# EAGLE design mux_imu (EAGLE 9.6.2)
COMPANY: ADAFRUIT INDUSTRIES; DRAWN: KTOWN; REV: A
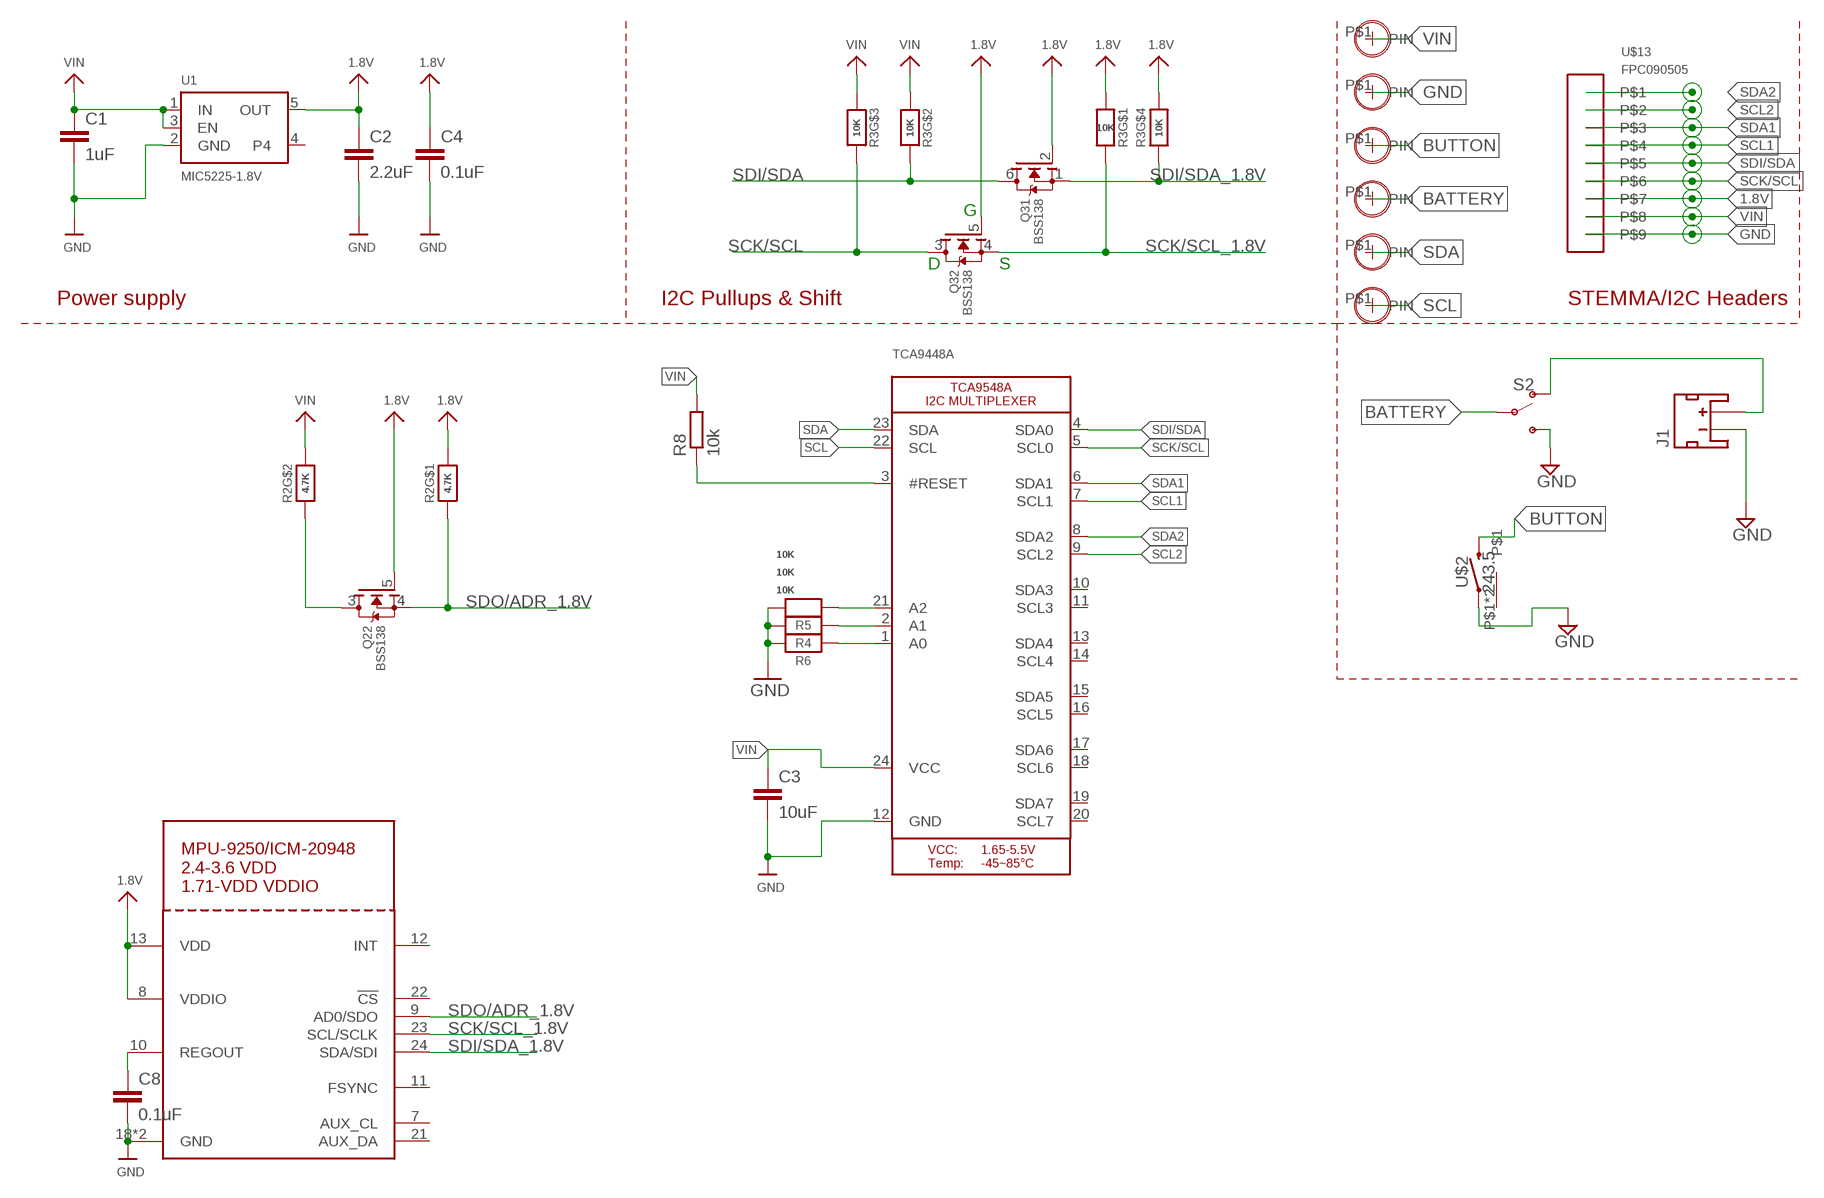
[diagram p0: schematic, sheet 1]

## Parts
C1  1uF  C-EUC0402  [C0402]
C2  2.2uF  C-EUC0402  [C0402]
C3  10uF  C-EUC0402  [C0402]
C4  0.1uF  C-EUC0402  [C0402]
C8  0.1uF  C-EUC0402  [C0402]
J1  JST_2MM_MALE  [JST-2-SMD]
Q2  BSS138  MOSFET-N_DUAL  [SOT363]
Q3  BSS138  MOSFET-N_DUAL  [SOT363]
R2  4.7K  RESISTOR_4PACK  [RESPACK_4X0603]
R3  10K  RESISTOR_4PACK  [RESPACK_4X0603]
R4  10K  RESISTOR0805_NOOUTLINE  [0805-NO]
R5  10K  RESISTOR0805_NOOUTLINE  [0805-NO]
R6  10K  RESISTOR0805_NOOUTLINE  [0805-NO]
R8  10k  R-EU_R0805  [R0805]
S2  SWITCH-SPDT-SMD-RIGHT-ANGLE  [SWITCH_SPST_SMD_A]
TCA9448A  MICROBUILDER_TCA9548A  [MICROBUILDER_TSSOP24]
U1  MIC5225-1.8V  VREG_SOT23-5  [SOT23-5]
U$2  243.5  [2*4*3.5]
U$3  M0.9-HOLE0.9MM  [M0.9-HOLE]
U$6  M0.9-HOLE0.9MM  [M0.9-HOLE]
U$8  M0.9-HOLE0.9MM  [M0.9-HOLE]
U$9  M0.9-HOLE0.9MM  [M0.9-HOLE]
U$10  M0.9-HOLE0.9MM  [M0.9-HOLE]
U$12  M0.9-HOLE0.9MM  [M0.9-HOLE]
U$13  FPC090505  [FPC0905]
U$21  MPU-9250_ICM20948  [QFN24_3MM_NOEP]

## Nets
1.8V: C2.1 C4.1 Q2.5(2:G) Q3.2(1:G) Q3.5(2:G) R2.8 R3.4 R3.8 U1.5(OUT) U$13.P$7 U$21.8(VDDIO) U$21.13(VDD)
BATTERY: S2.2(P) U$10.P$1(PIN)
BUTTON: U$2.P$4 U$9.P$1(PIN)
GND: C1.2 C2.2 C3.2 C4.2 C8.2 J1.1(-) R4.2 R5.2 R6.2 S2.3(S) TCA9448A.12(GND) U1.2(GND) U$2.P$3 U$8.P$1(PIN) U$13.P$9 U$21.18(GND) U$21.20(GND)
N$2: R5.1 TCA9448A.21(A2)
N$3: J1.2(+) S2.1(O)
N$4: R4.1 TCA9448A.2(A1)
N$5: R6.1 TCA9448A.1(A0)
REGOUT: C8.1 U$21.10(REGOUT)
RESET: R8.1 TCA9448A.3(#RESET)
SCK/SCL: Q3.3(2:D) R3.6 TCA9448A.5(SCL0) U$13.P$6
SCK/SCL_1.8V: Q3.4(2:S) R3.1 U$21.23(SCL/SCLK)
SCL: TCA9448A.22(SCL) U$12.P$1(PIN)
SCL1: TCA9448A.7(SCL1) U$13.P$4
SCL2: TCA9448A.9(SCL2) U$13.P$2
SDA: TCA9448A.23(SDA) U$6.P$1(PIN)
SDA1: TCA9448A.6(SDA1) U$13.P$3
SDA2: TCA9448A.8(SDA2) U$13.P$1
SDI/SDA: Q3.6(1:D) R3.7 TCA9448A.4(SDA0) U$13.P$5
SDI/SDA_1.8V: Q3.1(1:S) R3.5 U$21.24(SDA/SDI)
SDO/ADR: Q2.3(2:D) R2.2
SDO/ADR_1.8V: Q2.4(2:S) R2.1 U$21.9(AD0/SDO)
VIN [highpower]: C1.1 C3.1 R2.7 R3.2 R3.3 R8.2 TCA9448A.24(VCC) U1.1(IN) U1.3(EN) U$3.P$1(PIN) U$13.P$8
Unconnected: J1.NC1(PAD1) J1.NC2(PAD2) Q2.1(1:S) Q2.2(1:G) Q2.6(1:D) R2.3 R2.4 R2.5 R2.6 TCA9448A.10(SDA3) TCA9448A.11(SCL3) TCA9448A.13(SDA4) TCA9448A.14(SCL4) TCA9448A.15(SDA5) TCA9448A.16(SCL5) TCA9448A.17(SDA6) TCA9448A.18(SCL6) TCA9448A.19(SDA7) TCA9448A.20(SCL7) U1.4 U$2.P$1 U$2.P$2 U$21.7(AUX_CL) U$21.11(FSYNC) U$21.12(INT) U$21.21(AUX_DA) U$21.22(!CS)

## Notes on the sheet
- G
- D | S
- Power supply | I2C Pullups & Shift | STEMMA/I2C Headers

## Library data of the parts
C1-C4 C8 = rcl:C-EU: CAPACITOR, European symbol; SPICEPREFIX: C
J1 = SparkFun-Connectors:JST_2MM_MALE: JST 2MM MALE RA CONNECTOR Two pin, compact surface mount connector. Commonly used as a battery input connection point. We really like the solid locking feeling and high current rating on these small connectors. We use these all the time as battery connectors. Mates to single-cell LiPo batteries. Here is the connector we sell at SparkFun: JST Right Angle Connector - White <https://www.sparkfun.com/products/8612> (PRT-08612) Datasheet <http://www.sparkfun.com/datasheets/Prototyping/Connectors/JST-Horizontal.pdf> It was used on these SparkFun products: SparkFun MOSFET Power Controller <https://www.sparkfun.com/products/11214> (PRT-11214) SparkFun Battery Babysitter - LiPo Battery Manager <https://www.sparkfun.com/products/13777> (PRT-13777) And many, many others that required a lipo battery connection.; PROD_ID: CONN-11443; SF_ID: PRT-08612
Q2 Q3 = microbuilder:MOSFET-N_DUAL: Dual N-Channel MOSFET SOT363 (2.0x1.25mm) 2N7002PS - 60V, 320mA [Digikey: 568-5984-1-ND]
R2 R3 = microbuilder:RESISTOR_4PACK: Resistor Packs (4 resistors) 4 x 0603 10K 1/16W - Digikey: YC164J-10KCT-ND
R4-R6 = microbuilder:RESISTOR: Resistors For new designs, use the packages preceded by an '_' character since they are more reliable: The following footprints should be used on most boards: _0402 - Standard footprint for regular board layouts _0603 - Standard footprint for regular board layouts _0805 - Standard footprint for regular board layouts _1206 - Standard footprint for regular board layouts For extremely tight-pitch boards where space is at a premium, the following 'micro-pitch' footprints can be used (smaller pads, no silkscreen outline, etc.): _0402MP - Micro-pitch footprint for very dense/compact boards _0603MP - Micro-pitch footprint for very dense/compact boards _0805MP - Micro-pitch footprint for very dense/compact boards _1206MP - Micro-pitch footprint for very dense/compact boards
R8 = rcl:R-EU_: RESISTOR, European symbol; SPICEPREFIX: R
S2 = SparkFun-Switches:SWITCH-SPDT: Single Pole, Double Throw (SPDT) Switch Single-pole, double-throw (SPDT) switch. Variant Overview SMD-AYZ0202 Surface Mount DPDT Switch <https://www.sparkfun.com/products/597> (COM-00597) Used on e.g. LilyPad Arduino USB - ATmega32U4 Board <https://www.sparkfun.com/products/12049> PTH-11.6X4.0MM SPDT Mini Power Switch <https://www.sparkfun.com/products/102> (COM-00102) Used on e.g. SparkFun Simon Says - Through-Hole Soldering Kit <https://www.sparkfun.com/products/10547> (KIT-10547) PTH-11.6X4.0MM-KIT KIT version of SPDT Mini Power Switch - Simplifies soldering by removing tStop of switch pins - only one side can be soldered. PTH-11.6X4.0MM-LOCK LOCK version of SPDT Mini Power Switch - Offset pins hold switch in place for easier soldering. SMD-RIGHT-ANGLE Surface Mount Right Angle Switch <https://www.sparkfun.com/products/10860> (COM-10860) Used on e.g. SparkFun ESP8266 Thing <https://www.sparkfun.com/products/13231>; PROD_ID: SWCH-10651; SF_SKU: COM-10860
TCA9448A = Adafruit TCA9548A:MICROBUILDER_TCA9548A: TCA9548A I2C Multiplexer
U1 = microbuilder:VREG_SOT23-5: SOT23-5 Fixed Voltage Regulators Part Current Out V Out V In V Dropout θJA (°C/W) TJ (°C) Digikey Part No. ADP121 150mA 3.3V 3.4-5.5V 0.09V @ 150mA -- -- ADP121-AUJZ33R7CT-ND ADP121 150mA 3.0V 3.1-5.5V 0.09V @ 150mA -- -- ADP121-AUJZ30R7CT-ND ADP122 300mA 3.3V 3.4-5.5V 0.085V @ 300mA -- -- ADP122AUJZ-3.3-R7CT-ND ADP1712 300mA 3.3V 3.5-5.5V 0.17V @ 300mA -- -- ADP1712AUJZ-3.3-R7TR-ND AP7311 (Low Cost) 150mA 3.3V 3.5-6V 0.15V @ 150mA -- -- AP7311-33WG-7DICT-ND LD39015M18R 150mA 1.8V 1.9V-5.5V 0.08V @ 100mA -- -- 497-6977-1-ND LP2985A-33DBVR 150mA 3.3V 3.3-16V 0.28V @ 150mA 206 150 296-18479-1-ND MCP1824T-3302E/OT 300mA 3.3V 3.5V-6V 0.2V @ 300mA -- -- MCP1824T-3302E/OTCT-ND MIC5205-2.5YM5 TR 150mA 2.5V 2.7-16V 0.165V @ 150mA -- -- 576-1257-2-ND MIC5205-3.0YM5 TR 150mA 3.0V 3.2V-16V 0.165V @ 150mA -- -- 576-1258-2-ND MIC5205-3.3YM5 TR 150mA 3.3V 3.5V-16V 0.165V @ 150mA -- -- 576-1259-2-ND TPS780330220 150mA 3.3V+2.2V 3.6-5.5V 250mV Max -- -- 296-23332-1-ND TDA3663/N1,135 100mA 3.3V 3.5-45V 0.18V @ 50mA -- -- 568-5343-1-ND Max operating temp can be calculated using θJA, TJ (max junction temperature), and power in watts. Set the "Maximum Ambient Temperature" until it reaches TJ ("Max Junction Temperature"), which is the absolute limit for safe use of the regulator: Heat Sink Temperature Calculator <http://www.daycounter.com/Calculators/Heat-Sink-Temperature-Calculator.phtml> For example, With 12V source into a 3.3V LP2985 and a 30mA load, we are dissipating (12V-3.3V) * 0.03A = 0.261W. With a θJA of 206 °C/W, a TJ of 150°C, and 261mW we can safely use the chip without a heat sink up to 75°C (=147.1°C Junction Temperature).
U$2 = 2x4x3.5sw:2*4*3.5
U$3 U$6 U$8-U$10 U$12 = M3-Hole:M0.9-HOLE
U$13 = my_library:FPC0905
U$21 = adafruit_sensor:MPU-9250: MPU-9250 3-Axis gyroscope and 3-Axis accelerometer

## Net classes
1 highpower: width 0.254 mm, drill 0.483 mm
2 lowpower: width 0.203 mm, drill 0.483 mm

## Board
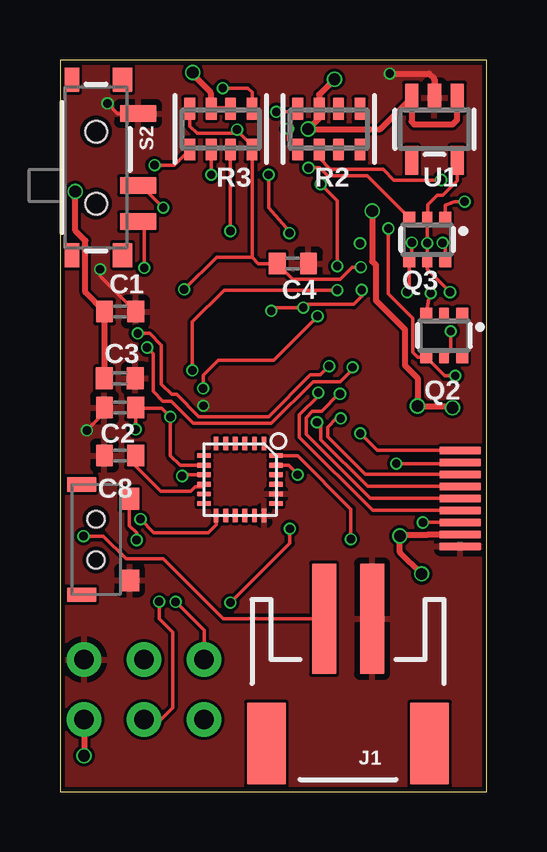
[diagram p1: board, top side]
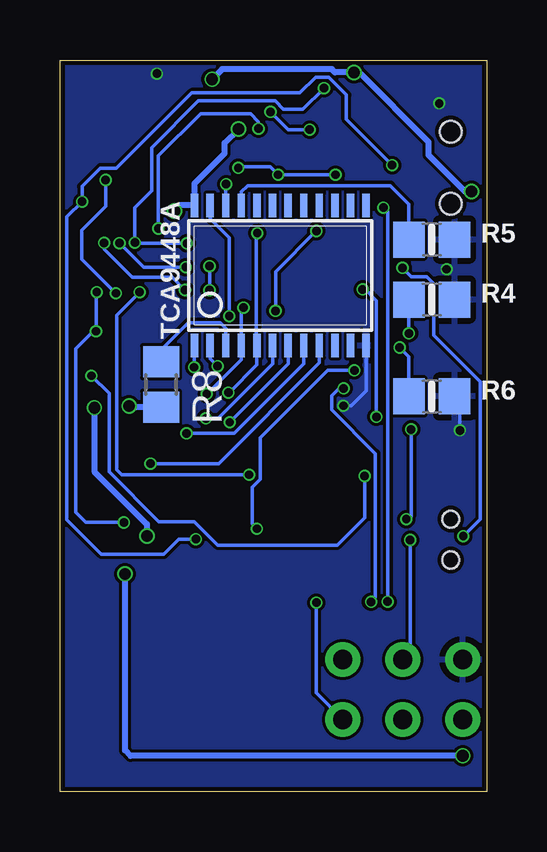
[diagram p2: board, bottom side, seen from below]

Size 17.78 x 30.48 mm. Coordinates in mm from the lower left corner, seen from the top.
Outline: 0,0 17.78,0 17.78,30.48 0,30.48 0,0
Copper layers (1*16): Top 0.035mm / dielectric 1.6mm / Bottom 0.035mm
Design rules "jlcpcb-2layers *": minimum track width 5mil, minimum drill 0.3mm, track to track 5mil, track to pad 5mil, pad to pad 5mil, via to via 5mil, smd to smd 5mil, copper to edge 0.2mm, drill to drill 6mil, minimum pad ring 10mil, minimum via ring 3mil, stop-mask expansion 4mil, vias tented up to drill 20mil, thermal gap 10mil

### Footprints (pad centres in the part's own frame; a part is rotated, then mirrored left to right if it is on the bottom)
C0402 = smd 0.7 x 0.9: 1 -0.65,0; 2 0.65,0
JST-2-SMD = smd 1 x 4.6: 1 -1,-3.7; 2 1,-3.7 | smd 1.6 x 3.4: NC1 -3.4,1.5; NC2 3.4,1.5
SOT363 = smd 0.5 x 0.5: 1 -0.75,-0.9; 3 0.75,-0.9; 4 0.75,0.9; 6 -0.75,0.9 | smd 0.4 x 0.5: 2 0,-0.9; 5 0,0.9
RESPACK_4X0603 = smd 0.45 x 0.9: 1 -1.3,-0.85; 2 -0.4,-0.85; 3 0.4,-0.85; 4 1.3,-0.85; 5 1.3,0.85; 6 0.4,0.85; 7 -0.4,0.85; 8 -1.3,0.85
0805-NO = smd 1.3 x 1.5: 1 -0.95,0; 2 0.95,0
R0805 = smd 1.3 x 1.5: 1 -0.95,0; 2 0.95,0
SWITCH_SPST_SMD_A = smd 0.7 x 1.5: 1 -2.25,-1.75; 2 -0.75,-1.75; 3 2.25,-1.75 | smd 1 x 0.6: GND1 -3.65,1; GND3 3.65,1 | smd 1 x 0.8: GND2 -3.65,-1.1; GND4 3.65,-1.1 | hole 0.9: -1.5,0; 1.5,0
MICROBUILDER_TSSOP24 = smd 0.305 x 0.991: 1 -3.575,-2.918; 2 -2.925,-2.918; 3 -2.275,-2.918; 4 -1.625,-2.918; 5 -0.975,-2.918; 6 -0.325,-2.918; 7 0.325,-2.918; 8 0.975,-2.918; 9 1.625,-2.918; 10 2.275,-2.918; 11 2.925,-2.918; 12 3.575,-2.918; 13 3.575,2.918; 14 2.925,2.918; 15 2.275,2.918; 16 1.625,2.918; 17 0.975,2.918; 18 0.325,2.918; 19 -0.325,2.918; 20 -0.975,2.918; 21 -1.625,2.918; 22 -2.275,2.918; 23 -2.925,2.918; 24 -3.575,2.918
SOT23-5 = smd 0.55 x 1.2: 1 -0.95,-1.3; 2 0,-1.3; 3 0.95,-1.3; 4 0.95,1.3; 5 -0.95,1.3
2*4*3.5 = smd 0.6 x 1.2: P$1 2.3,0.6; P$2 -2.3,0.6 | smd 0.9 x 0.8: P$3 -1.7,-1.4; P$4 1.7,-1.4 | hole 0.7: -0.85,0; 0.85,0
M0.9-HOLE = drill 0.8 pad 0.55: P$1 0,0
FPC0905 = smd 0.3 x 1.7: P$1 -2,0; P$2 -1.5,0; P$3 -1,0; P$4 -0.5,0; P$5 0,0; P$6 0.5,0; P$7 1,0; P$8 1.5,0; P$9 2,0
QFN24_3MM_NOEP = smd 0.55 x 0.2: 1 -1.5,1; 2 -1.5,0.6; 3 -1.5,0.2; 4 -1.5,-0.2; 5 -1.5,-0.6; 6 -1.5,-1; 13 1.5,-1; 14 1.5,-0.6; 15 1.5,-0.2; 16 1.5,0.2; 17 1.5,0.6; 18 1.5,1 | smd 0.2 x 0.55: 7 -1,-1.5; 8 -0.6,-1.5; 9 -0.2,-1.5; 10 0.2,-1.5; 11 0.6,-1.5; 12 1,-1.5; 19 1,1.5; 20 0.6,1.5; 21 0.2,1.5; 22 -0.2,1.5; 23 -0.6,1.5; 24 -1,1.5

### Placement (x,y rotation side)
C1  2.5,20 0 top
C2  2.5,16 180 top
C3  2.49,17.22 0 top
C4  9.7,22 0 top
C8  2.5,14 180 top
J1  12,3.5 180 top
Q2  16,19 180 top
Q3  15.3,23 180 top
R2  11.2,27.6 0 top
R3  6.7,27.6 180 top
R4  2.29,20.5 0 bottom
R5  2.29,23 0 bottom
R6  2.29,16.46 0 bottom
R8  13.57,16.96 270 bottom
S2  1.5,26 90 top
TCA9448A  8.6,21.5 0 bottom
U1  15.6,27.6 180 top
U$2  24*3.5  [2*4*3.5]  1.5,10.5 90 top
U$3  1,3 0 top
U$6  6,5.5 0 top
U$8  1,5.5 0 top
U$9  3.5,5.5 0 top
U$10  3.5,3 0 top
U$12  6,3 0 top
U$13  16.68,12.21 270 top
U$21  7.5,13 270 top

### Tracks (layer width: path | path; a pad name or v marks a point on that pad's centre or on a via)
1.8V  (via drill 0.35)
  Top 0.152: U1.5 16.55,25.45 15.94,24.84 15.71,24.84 15.32,24.45 15.32,23.92 Q3.2 v15.3,22.85 Q3.5 15.3,21.76 v16.25,20.81 | 7.48,27.42 5.71,27.42 5.4,27.73 R3.4 | 7.48,27.42 7.38,27.52 v7.38,27.58 | 7.48,27.42 8,26.9 R3.8 8,22.27 | v12.54,21.85 12.19,21.85 11.68,21.35 9.7,21.35 C4.1 8.27,22 8,22.27 | v9.01,28.32 9.77,28.32 R2.8 | v3.35,11.35 3.91,10.79 6.18,10.79 6.5,11.11 U$21.13 | v3.15,15.09 C2.1 3.18,15.97 4.24,15.97 v4.6,15.61 4.6,14 5,13.6 U$21.8 | v16.28,19.18 16.28,18.38 Q2.5 | v5.17,20.92 6.52,22.27 8,22.27 | U$13.P$7 v15.12,11.21
  Bottom 0.152: v12.54,21.85 14.3,21.85 v15.3,22.85 | v7.38,27.58 8.27,27.58 v9.01,28.32 | v3.15,15.09 3.15,11.48 3.28,11.35 v3.35,11.35 | v4.6,15.61 4.6,20.45 5.07,20.92 v5.17,20.92 | v16.25,20.81 16.28,20.78 16.28,19.26 | 16.28,19.26 v16.28,19.18 | v15.12,11.21 16.71,11.21 17.13,11.63 17.13,18.45 16.32,19.26 16.28,19.26
BATTERY  (via drill 0.35)
  Top 0.152: v4.3,24.33 3.38,25.25 S2.2 | v4.13,7.91 4.13,7.19 4.69,6.63 4.69,3.5 4.19,3 U$10.P$1
  Bottom 0.152: v4.3,24.33 4.13,24.16 v4.13,7.91
BUTTON  (via drill 0.35)
  Top 0.152: U$2.P$4 2.89,11.08 3.19,10.78 v3.19,10.48
  Bottom 0.152: v3.19,10.48 3.19,5.81 U$9.P$1
GND  (via drill 0.35)
  Top 0.152: C2.2 1.85,15.78 v1.12,15.05 | C1.2 1.67,21.48 v1.67,21.76 | S2.3 2.4,28.25 v1.98,28.67
  Top 0.254: v13.74,29.91 15.37,29.91 15.61,29.67 U1.2
  Bottom 0.152: v1.12,15.05 1.12,16.24 R6.2 | TCA9448A.12 5.03,16.7 5.65,16.07 v5.97,16.07
  pour Bottom: 0,30.5 17.8,30.5 17.8,0.1 0,0.1 0,30.4
  pour Top: 0,30.5 17.9,30.5 17.9,0 0.1,0 0,0.1
N$2
  Bottom 0.152: TCA9448A.21 10.22,24.98 9.96,25.25 4.02,25.25 3.24,24.47 R5.1
N$3  (via drill 0.35)
  Top 0.152: S2.1 3.51,23.49 v3.51,21.82 | v0.98,10.64 1.81,10.64 2.76,9.69 4.31,9.69 6.8,7.2 J1.2
  Bottom 0.152: v0.98,10.64 0.28,11.34 0.28,17.08 2.2,19.01 2.2,21.15 2.51,21.45 3.14,21.45 v3.51,21.82
N$4  (via drill 0.35)
  Top 0.152: v3.24,19.09 3.73,19.09 4.23,18.6 4.23,16.97 4.65,16.55 4.86,16.55 5.79,15.62 8.69,15.62 10.43,17.36 10.84,17.36 v11.21,17.73
  Bottom 0.152: v11.21,17.73 11.53,18.04 TCA9448A.2 | R4.1 v3.24,19.09
N$5  (via drill 0.35)
  Top 0.152: v12.19,17.68 12.19,17.59 11.68,17.08 10.55,17.08 8.81,15.34 5.56,15.34 4.63,16.27 4.28,16.27 3.88,16.67 3.88,18.25 v3.63,18.5
  Bottom 0.152: v12.19,17.68 12.19,18.57 TCA9448A.1 | v3.63,18.5 3.24,18.11 R6.1
REGOUT
  Top 0.152: C8.1 3.15,13.56 4.2,12.51 5.45,12.51 5.64,12.7 5.9,12.7 U$21.10
RESET
  Bottom 0.152: TCA9448A.3 10.88,19.3 11.11,19.54 12.43,19.54 13.57,18.4 R8.1
SCK/SCL  (via drill 0.35)
  Top 0.152: R3.6 v6.3,25.7 | v9.56,23.27 9.56,23.34 8.69,24.33 v8.69,25.7 | v10.35,25.99 10.82,25.99 11.15,25.65 12.8,25.65 Q3.3 | v10.76,16.62 10.76,16.48 9.97,15.69 9.97,14.76 13.03,11.71 U$13.P$6
  Bottom 0.152: v6.3,25.7 v8.69,25.7 9.02,26.03 10.31,26.03 v10.35,25.99 | v10.76,16.62 10.74,16.62 9.57,17.79 TCA9448A.5 9.6,18.61 9.6,23.23 v9.56,23.27
SCK/SCL_1.8V  (via drill 0.35)
  Top 0.152: v14.46,20.81 14.55,20.9 Q3.4 14.66,22.21 v14.66,22.87 | U$21.23 9.53,13.6 9.9,13.22 v9.9,13.2 | R3.1 8,29.14 7.83,29.31 v6.78,29.31
  Bottom 0.152: v12.5,22.84 14.63,22.84 v14.66,22.87 14.66,24.33 13.96,25.03 13.96,26.83 12.02,28.77 8.81,28.77 8.47,28.43 7.66,28.43 v6.78,29.31 | v9.9,13.2 15.21,13.2 15.43,13.42 15.43,19.84 v14.46,20.81
SCL  (via drill 0.35)
  Top 0.152: v10.86,25.31 11.55,24.61 v11.55,21.89 | v11.55,20.89 6.84,20.89 5.51,19.56 v5.51,17.55 | v7.1,7.87 9.58,10.35 v9.58,10.95
  Bottom 0.152: TCA9448A.22 10.88,25.29 v10.86,25.31 | v11.55,21.89 v11.55,20.89 | v5.51,17.55 6.63,17.55 9.45,14.73 9.45,13.01 9.78,12.68 9.78,11.15 v9.58,10.95 | U$12.P$1 7.11,4.11 v7.11,7.86 v7.1,7.87
SCL1  (via drill 0.35)
  Top 0.152: v10.71,15.39 10.87,15.22 10.87,14.66 12.82,12.71 U$13.P$4
  Bottom 0.152: TCA9448A.7 8.28,17.82 v10.71,15.39
SCL2  (via drill 0.35)
  Top 0.152: v14.01,13.66 16.63,13.66 U$13.P$2
  Bottom 0.152: TCA9448A.9 6.97,17.86 11.18,13.66 v14.01,13.66
SDA  (via drill 0.35)
  Top 0.152: v10.73,19.81 8.9,17.98 6.59,17.98 5.96,17.35 v5.96,16.8 | U$6.P$1 6,6.72 v4.82,7.9
  Bottom 0.152: TCA9448A.23 11.53,23.86 10.73,23.07 v10.73,19.81 | v4.82,7.9 4.64,8.08 4.64,14.08 6.46,15.9 6.46,16.48 6.14,16.8 v5.96,16.8
SDA1  (via drill 0.35)
  Top 0.152: v11.7,15.55 11.51,15.55 11.15,15.19 11.15,14.77 12.71,13.21 U$13.P$3
  Bottom 0.152: TCA9448A.6 8.93,17.82 11.19,15.55 v11.7,15.55
SDA2  (via drill 0.35)
  Top 0.152: U$13.P$1 13.22,14.21 v12.51,14.92
  Bottom 0.152: TCA9448A.8 7.62,17.82 10.52,14.92 v12.51,14.92
SDI/SDA  (via drill 0.35)
  Top 0.152: R3.7 v7.1,23.36 | v15.94,22.86 16.05,22.75 Q3.6 | v8.8,20.03 8.93,20.16 v10.13,20.16 10.27,20.29 12.23,20.29 12.57,20.64 v12.57,20.9 | v11.67,16.57 11.62,16.57 10.9,15.84 10.52,15.84 10.25,15.57 10.25,14.88 12.92,12.21 U$13.P$5
  Bottom 0.152: v15.94,22.86 v15.93,22.85 15.93,22.58 14.77,21.42 13.1,21.42 v12.57,20.9 | v7.1,23.36 8.8,21.66 v8.8,20.03 | v11.67,16.57 11.64,16.57 10.22,17.98 TCA9448A.4 10.22,20.07 v10.13,20.16
SDI/SDA_1.8V  (via drill 0.35)
  Top 0.152: Q3.1 16.05,24.43 16.42,24.58 v16.86,24.58 | R3.5 4.75,26.1 v3.94,26.1 | U$21.24 9.16,14 9.16,13.99 9.9,13.99 12.12,11.77 v12.12,10.52
  Bottom 0.152: v12.12,10.52 12.83,10.52 13.46,9.89 16.05,9.89 17.49,11.33 17.49,23.95 v16.86,24.58 16.86,25.21 16.1,25.97 15.43,25.97 12.29,29.11 7.78,29.11 7.13,29.76 6.59,29.76 5.85,29.02 5.85,28.01 v3.94,26.1
SDO/ADR  (via drill 0.35)
  Top 0.152: R2.2 10.8,26.4 11.27,25.93 13.46,25.93 13.91,25.48 v15.88,25.48 | v15.45,20.76 15.4,20.75 Q2.3
  Bottom 0.152: v15.88,25.48 15.88,24.38 16.87,23.39 16.87,22.18 v15.45,20.76
SDO/ADR_1.8V  (via drill 0.35)
  Top 0.152: R2.1 9.52,27.13 9.52,27.16 9.51,27.13 v9.51,27.62 | v13.68,23.46 13.68,20.75 14.7,19.73 14.7,18.31 14.91,18.1 Q2.4 16.03,17.32 v16.47,17.32 | U$21.9 5.14,13.2 v5.09,13.15
  Bottom 0.152: v9.51,27.62 9.51,27.91 9.84,28.24 11.93,28.24 13.68,26.49 v13.68,23.46 | v5.09,13.15 5.09,11.41 6.24,10.27 11.21,10.27 12.19,11.25 13.65,11.25 15.73,13.33 15.73,16.59 v16.47,17.32
VIN  (via drill 0.48)
  Top 0.254: U1.1 16.55,27.99 16.36,27.8 14.76,27.8 14.65,27.91 U1.3 13.35,27.6 13.35,27.61 v10.34,27.61 10.8,28.06 R2.7 10.8,29.04 v11.44,29.68 | R3.2 R3.3 6.3,29.08 6.28,29.1 6.28,29.14 5.53,29.88 v5.53,29.96 | v0.64,25 0.64,23.37 1.05,22.95 1.05,20.8 C1.1 C3.1 | v13.01,24.19 13.01,22.09 13.16,21.94 13.16,20.47 14.37,19.26 14.37,17.76 14.9,17.23 v14.9,16.06 16.28,16.06 v16.35,15.99 | U$3.P$1 v1,1.49 | v15.07,9.07 14.16,9.98 v14.16,10.65 14.22,10.71 15.33,10.71 U$13.P$8
  Bottom 0.254: v11.44,29.68 11.02,30.09 6.46,30.09 6.32,29.96 v5.53,29.96 5.32,29.96 2.42,27.06 2.42,26.52 0.91,25 v0.64,25 | v10.34,27.61 10.93,27.02 10.93,26.58 12.18,25.33 TCA9448A.24 12.76,24.42 v13,24.18 v13.01,24.19 | R8.2 14.85,16.01 v14.9,16.06 | v1,1.49 14.85,1.49 15.07,1.71 v15.07,9.07 | v16.35,15.99 16.35,13.33 14.16,11.14 v14.16,10.65